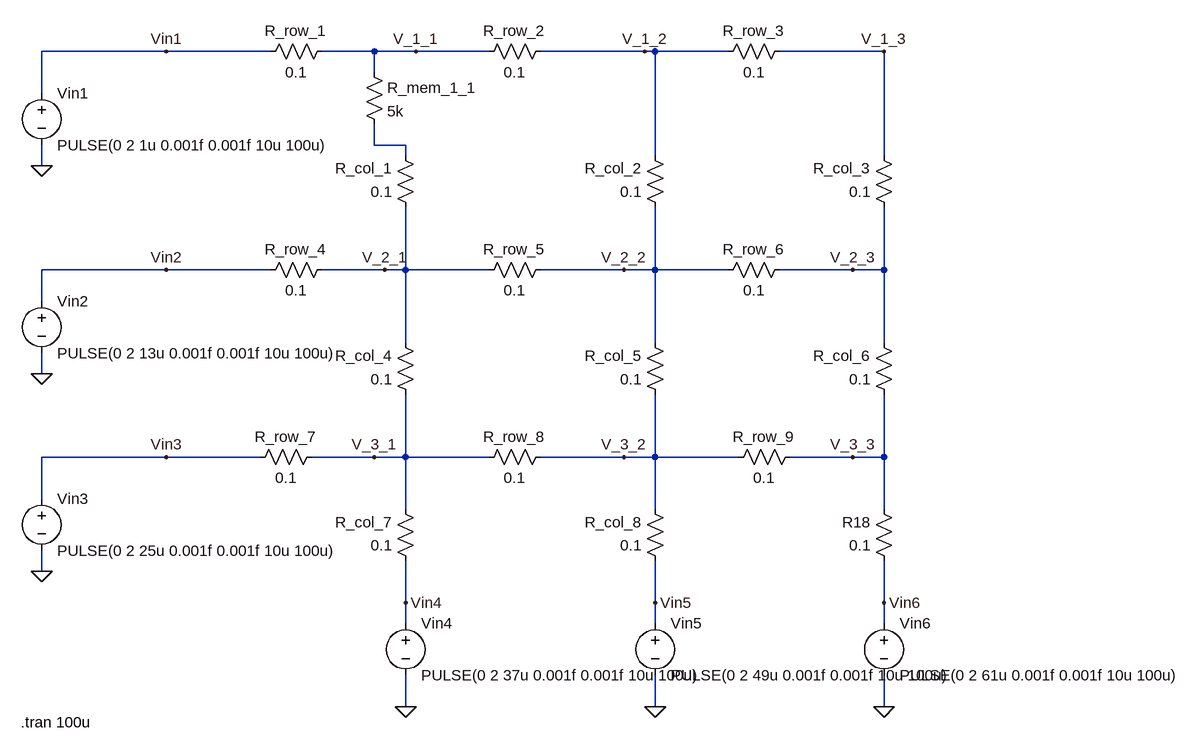
[diagram p0: schematic Memristor_one_device_1_1_ver_8.asc]
Memristor_one_device_1_1_ver_8.asc, the LTspice schematic file:
Version 4
SHEET 1 1848 1064
WIRE 256 16 64 16
WIRE 416 16 256 16
WIRE 576 16 496 16
WIRE 640 16 576 16
WIRE 752 16 640 16
WIRE 992 16 832 16
WIRE 1008 16 992 16
WIRE 1120 16 1008 16
WIRE 1360 16 1200 16
WIRE 576 48 576 16
WIRE 64 80 64 16
WIRE 576 160 576 128
WIRE 624 160 576 160
WIRE 624 176 624 160
WIRE 1008 176 1008 16
WIRE 1360 176 1360 16
WIRE 64 192 64 160
WIRE 256 352 64 352
WIRE 416 352 256 352
WIRE 592 352 496 352
WIRE 624 352 624 256
WIRE 624 352 592 352
WIRE 752 352 624 352
WIRE 960 352 832 352
WIRE 1008 352 1008 256
WIRE 1008 352 960 352
WIRE 1120 352 1008 352
WIRE 1312 352 1200 352
WIRE 1360 352 1360 256
WIRE 1360 352 1312 352
WIRE 64 400 64 352
WIRE 624 464 624 352
WIRE 1008 464 1008 352
WIRE 1360 464 1360 352
WIRE 64 512 64 480
WIRE 256 640 64 640
WIRE 400 640 256 640
WIRE 576 640 480 640
WIRE 624 640 624 544
WIRE 624 640 576 640
WIRE 752 640 624 640
WIRE 960 640 832 640
WIRE 1008 640 1008 544
WIRE 1008 640 960 640
WIRE 1136 640 1008 640
WIRE 1312 640 1216 640
WIRE 1360 640 1360 544
WIRE 1360 640 1312 640
WIRE 64 704 64 640
WIRE 624 720 624 640
WIRE 1008 720 1008 640
WIRE 1360 720 1360 640
WIRE 64 816 64 784
WIRE 624 864 624 800
WIRE 1008 864 1008 800
WIRE 1360 864 1360 800
WIRE 624 896 624 864
WIRE 1008 896 1008 864
WIRE 1360 896 1360 864
WIRE 624 1024 624 976
WIRE 1008 1024 1008 976
WIRE 1360 1024 1360 976
FLAG 64 192 0
FLAG 64 512 0
FLAG 64 816 0
FLAG 624 1024 0
FLAG 1008 1024 0
FLAG 1360 1024 0
FLAG 256 16 Vin1
FLAG 256 352 Vin2
FLAG 256 640 Vin3
FLAG 624 864 Vin4
FLAG 1008 864 Vin5
FLAG 1360 864 Vin6
FLAG 640 16 V_1_1
FLAG 992 16 V_1_2
FLAG 1360 16 V_1_3
FLAG 592 352 V_2_1
FLAG 960 352 V_2_2
FLAG 1312 352 V_2_3
FLAG 576 640 V_3_1
FLAG 960 640 V_3_2
FLAG 1312 640 V_3_3
SYMBOL voltage 64 64 R0
WINDOW 123 0 0 Left 0
WINDOW 39 0 0 Left 0
SYMATTR InstName Vin1
SYMATTR Value PULSE(0 2 1u 0.001f 0.001f 10u 100u)
SYMBOL voltage 64 384 R0
WINDOW 123 0 0 Left 0
WINDOW 39 0 0 Left 0
SYMATTR InstName Vin2
SYMATTR Value PULSE(0 2 13u 0.001f 0.001f 10u 100u)
SYMBOL voltage 64 688 R0
WINDOW 123 0 0 Left 0
WINDOW 39 0 0 Left 0
SYMATTR InstName Vin3
SYMATTR Value PULSE(0 2 25u 0.001f 0.001f 10u 100u)
SYMBOL voltage 624 880 R0
WINDOW 123 0 0 Left 0
WINDOW 39 0 0 Left 0
SYMATTR InstName Vin4
SYMATTR Value PULSE(0 2 37u 0.001f 0.001f 10u 100u)
SYMBOL voltage 1008 880 R0
WINDOW 123 0 0 Left 0
WINDOW 39 0 0 Left 0
SYMATTR InstName Vin5
SYMATTR Value PULSE(0 2 49u 0.001f 0.001f 10u 100u)
SYMBOL voltage 1360 880 R0
WINDOW 123 0 0 Left 0
WINDOW 39 0 0 Left 0
SYMATTR InstName Vin6
SYMATTR Value PULSE(0 2 61u 0.001f 0.001f 10u 100u)
SYMBOL res 512 0 R90
WINDOW 0 0 56 VBottom 2
WINDOW 3 32 56 VTop 2
SYMATTR InstName R_row_1
SYMATTR Value 0.1
SYMBOL res 848 0 R90
WINDOW 0 0 56 VBottom 2
WINDOW 3 32 56 VTop 2
SYMATTR InstName R_row_2
SYMATTR Value 0.1
SYMBOL res 1216 0 R90
WINDOW 0 0 56 VBottom 2
WINDOW 3 32 56 VTop 2
SYMATTR InstName R_row_3
SYMATTR Value 0.1
SYMBOL res 512 336 R90
WINDOW 0 0 56 VBottom 2
WINDOW 3 32 56 VTop 2
SYMATTR InstName R_row_4
SYMATTR Value 0.1
SYMBOL res 848 336 R90
WINDOW 0 0 56 VBottom 2
WINDOW 3 32 56 VTop 2
SYMATTR InstName R_row_5
SYMATTR Value 0.1
SYMBOL res 1216 336 R90
WINDOW 0 0 56 VBottom 2
WINDOW 3 32 56 VTop 2
SYMATTR InstName R_row_6
SYMATTR Value 0.1
SYMBOL res 496 624 R90
WINDOW 0 0 56 VBottom 2
WINDOW 3 32 56 VTop 2
SYMATTR InstName R_row_7
SYMATTR Value 0.1
SYMBOL res 848 624 R90
WINDOW 0 0 56 VBottom 2
WINDOW 3 32 56 VTop 2
SYMATTR InstName R_row_8
SYMATTR Value 0.1
SYMBOL res 1232 624 R90
WINDOW 0 0 56 VBottom 2
WINDOW 3 32 56 VTop 2
SYMATTR InstName R_row_9
SYMATTR Value 0.1
SYMBOL res 640 272 R180
WINDOW 0 36 76 Left 2
WINDOW 3 36 40 Left 2
SYMATTR InstName R_col_1
SYMATTR Value 0.1
SYMBOL res 1024 272 R180
WINDOW 0 36 76 Left 2
WINDOW 3 36 40 Left 2
SYMATTR InstName R_col_2
SYMATTR Value 0.1
SYMBOL res 1376 272 R180
WINDOW 0 36 76 Left 2
WINDOW 3 36 40 Left 2
SYMATTR InstName R_col_3
SYMATTR Value 0.1
SYMBOL res 640 560 R180
WINDOW 0 36 76 Left 2
WINDOW 3 36 40 Left 2
SYMATTR InstName R_col_4
SYMATTR Value 0.1
SYMBOL res 1024 560 R180
WINDOW 0 36 76 Left 2
WINDOW 3 36 40 Left 2
SYMATTR InstName R_col_5
SYMATTR Value 0.1
SYMBOL res 1376 560 R180
WINDOW 0 36 76 Left 2
WINDOW 3 36 40 Left 2
SYMATTR InstName R_col_6
SYMATTR Value 0.1
SYMBOL res 640 816 R180
WINDOW 0 36 76 Left 2
WINDOW 3 36 40 Left 2
SYMATTR InstName R_col_7
SYMATTR Value 0.1
SYMBOL res 1024 816 R180
WINDOW 0 36 76 Left 2
WINDOW 3 36 40 Left 2
SYMATTR InstName R_col_8
SYMATTR Value 0.1
SYMBOL res 1376 816 R180
WINDOW 0 36 76 Left 2
WINDOW 3 36 40 Left 2
SYMATTR InstName R18
SYMATTR Value 0.1
SYMBOL res 560 32 R0
SYMATTR InstName R_mem_1_1
SYMATTR Value 5k
TEXT 32 1048 Left 2 !.tran 100u

The netlist it stands for:
* Memristor_one_device_1_1_ver_8.asc
Vin1 Vin1 0 PULSE(0 2 1u 0.001f 0.001f 10u 100u)
Vin2 Vin2 0 PULSE(0 2 13u 0.001f 0.001f 10u 100u)
Vin3 Vin3 0 PULSE(0 2 25u 0.001f 0.001f 10u 100u)
Vin4 Vin4 0 PULSE(0 2 37u 0.001f 0.001f 10u 100u)
Vin5 Vin5 0 PULSE(0 2 49u 0.001f 0.001f 10u 100u)
Vin6 Vin6 0 PULSE(0 2 61u 0.001f 0.001f 10u 100u)
R_row_1 V_1_1 Vin1 0.1
R_row_2 V_1_2 V_1_1 0.1
R_row_3 V_1_3 V_1_2 0.1
R_row_4 V_2_1 Vin2 0.1
R_row_5 V_2_2 V_2_1 0.1
R_row_6 V_2_3 V_2_2 0.1
R_row_7 V_3_1 Vin3 0.1
R_row_8 V_3_2 V_3_1 0.1
R_row_9 V_3_3 V_3_2 0.1
R_col_1 V_2_1 N001 0.1
R_col_2 V_2_2 V_1_2 0.1
R_col_3 V_2_3 V_1_3 0.1
R_col_4 V_3_1 V_2_1 0.1
R_col_5 V_3_2 V_2_2 0.1
R_col_6 V_3_3 V_2_3 0.1
R_col_7 Vin4 V_3_1 0.1
R_col_8 Vin5 V_3_2 0.1
R18 Vin6 V_3_3 0.1
R_mem_1_1 V_1_1 N001 5k
.tran 100u
.backanno
.end